# Altium project Phaser45.PrjPcb
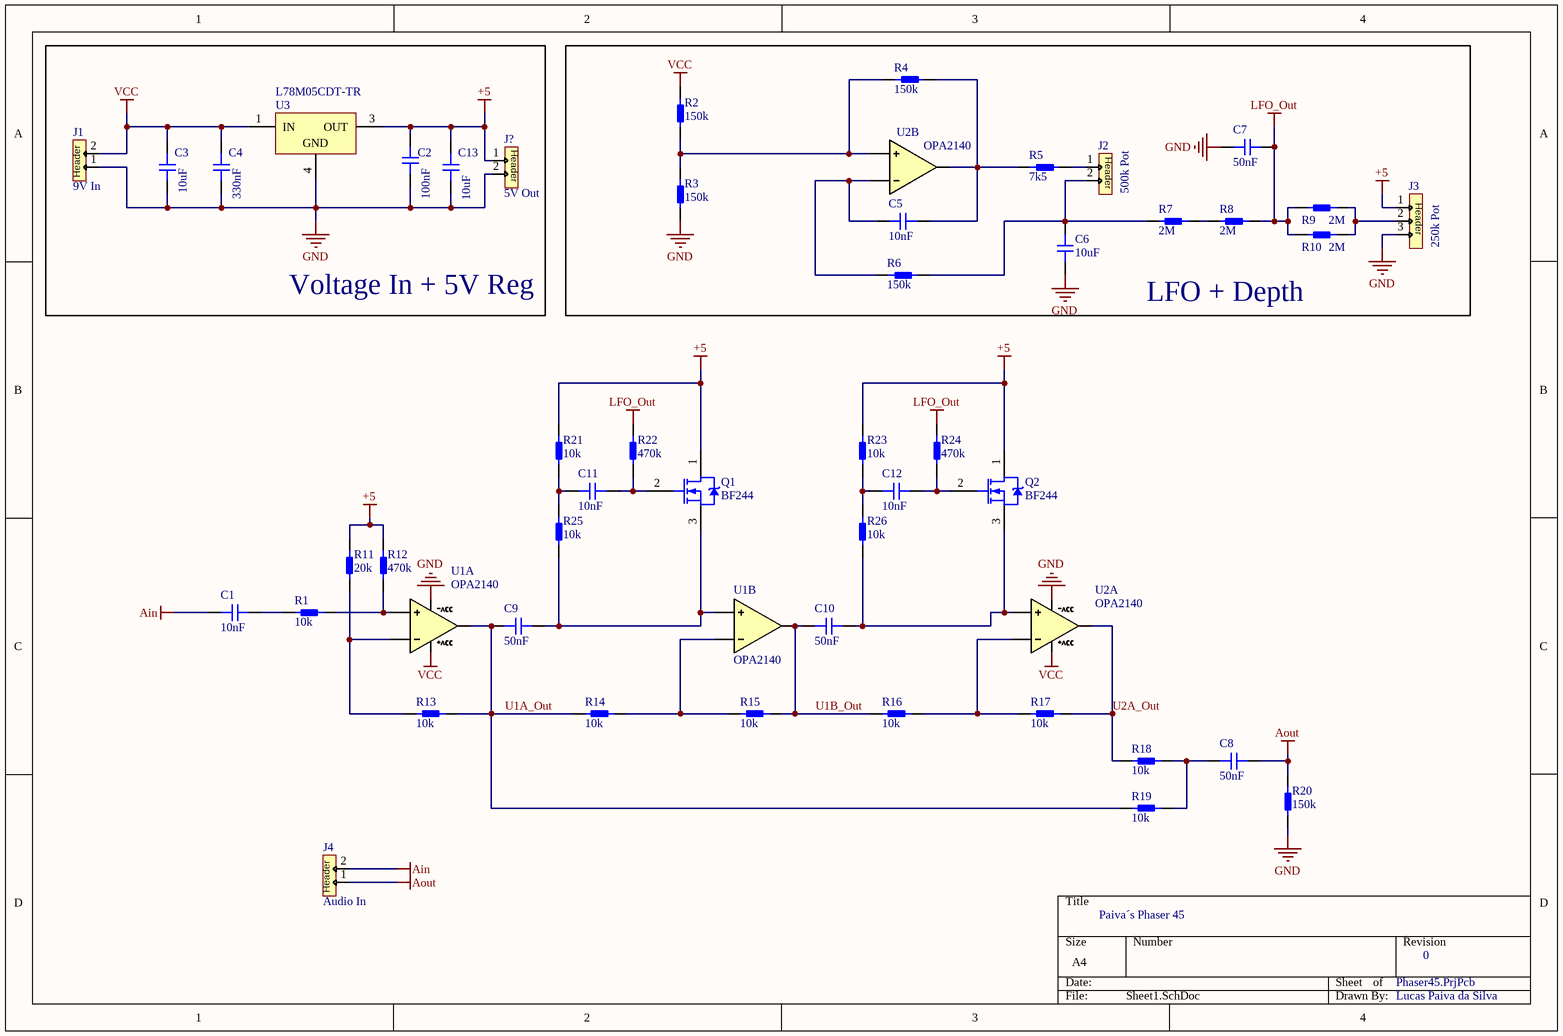
[diagram p0: Sheet1.SchDoc]
1 sheet, 49 parts. Net scope: global (net labels, ports and power ports of the same name join across sheets).
Board file: PCB1.PcbDoc

## Sheet Sheet1.SchDoc
size A4; Author: Lucas Paiva da Silva; Revision: 0; SheetNumber: 1; SheetTotal: 1

### Parts
C1  10nF  [SMD0805C]
C2  100nF  [SMD0805C]
C3  10uF  [SMD0805C]
C4  330nF  [SMD0805C]
C5  10nF  [SMD0805C]
C6  10uF  [SMD0805C]
C7  50nF  [SMD0805C]
C8  50nF  [SMD0805C]
C9  50nF  [SMD0805C]
C10  50nF  [SMD0805C]
C11  10nF  [SMD0805C]
C12  10nF  [SMD0805C]
C13  10uF  [SMD0805C]
J1  9V In  [PIN_HEAD_S_2_2.54]
J2  500k Pot  [PIN_HEAD_S_2_2.54]
J3  250k Pot  [PIN_HEAD_S_3_2.54]
J4  Audio In  [PIN_HEAD_S_2_2.54]
J?  5V Out  [PIN_HEAD_S_2_2.54]
Q1  BF244  [ONSC-TO-92-3-29-11]
Q2  BF244  [ONSC-TO-92-3-29-11]
R1  10k  [SMD1206R]
R2  150k  [SMD1206R]
R3  150k  [SMD1206R]
R4  150k  [SMD1206R]
R5  7k5  [SMD1206R]
R6  150k  [SMD1206R]
R7  2M  [SMD1206R]
R8  2M  [SMD1206R]
R9  2M  [SMD1206R]
R10  2M  [SMD1206R]
R11  20k  [SMD1206R]
R12  470k  [SMD1206R]
R13  10k  [SMD1206R]
R14  10k  [SMD1206R]
R15  10k  [SMD1206R]
R16  10k  [SMD1206R]
R17  10k  [SMD1206R]
R18  10k  [SMD1206R]
R19  10k  [SMD1206R]
R20  150k  [SMD1206R]
R21  10k  [SMD1206R]
R22  470k  [SMD1206R]
R23  10k  [SMD1206R]
R24  470k  [SMD1206R]
R25  10k  [SMD1206R]
R26  10k  [SMD1206R]
U1  OPA2140  [SOIC8]  (parts A,B of 2)
U2  OPA2140  [SOIC8]  (parts A,B of 2)
U3  L78M05CDT-TR  [TO-252_L]

### Blocks framed on the sheet
Voltage In + 5V Reg: C2-C4 C13 J1 J? U3
LFO + Depth: C5-C7 J2 J3 R2-R10 U2

### Nets
+5: C2.2 C13.2 J3.1 J?.1 Q1.1(D) Q2.1(D) R11.2 R12.2 R21.2 R23.2 U3.3(OUT)
Ain: C1.1 J4.2
Aout: C8.2 J4.1 R20.2
GND: C2.1 C3.1 C4.1 C6.2 C7.1 C13.1 J1.1 J3.3 J?.2 R3.1 R20.1 U1.4(-VCC) U2.4(-VCC) U3.4(GND)
LFO_Out: C7.2 R8.2 R9.1 R10.1 R22.2 R24.2
VCC: C3.2 C4.2 J1.2 R2.2 U1.8(+VCC) U2.8(+VCC) U3.1(IN)
U1A_Out: C9.1 R13.2 R14.1 R19.1 U1.1(OUT1)
U1B_Out: C10.1 R15.2 R16.1 U1.7(OUT2)
U2A_Out: R17.2 R18.1 U2.1(OUT1)
NetC1_2: C1.2 R1.1
NetC5_1: C5.1 R6.2 U2.6(IN2(-))
NetC5_2: C5.2 R4.1 R5.2 U2.7(OUT2)
NetC6_1: C6.1 J2.2 R6.1 R7.1
NetC8_1: C8.1 R18.2 R19.2
NetC9_2: C9.2 Q1.3(S) R25.1 U1.5(IN2(+))
NetC10_2: C10.2 Q2.3(S) R26.1 U2.3(IN1(+))
NetC11_1: C11.1 R21.1 R25.2
NetC11_2: C11.2 Q1.2(G) R22.1
NetC12_1: C12.1 R23.1 R26.2
NetC12_2: C12.2 Q2.2(G) R24.1
NetJ2_1: J2.1 R5.1
NetJ3_2: J3.2 R9.2 R10.2
NetR1_2: R1.2 R12.1 U1.3(IN1(+))
NetR2_1: R2.1 R3.2 R4.2 U2.5(IN2(+))
NetR7_2: R7.2 R8.1
NetR11_1: R11.1 R13.1 U1.2(IN1(-))
NetR14_2: R14.2 R15.1 U1.6(IN2(-))
NetR16_2: R16.2 R17.1 U2.2(IN1(-))

### Notes on the sheet
- Paiva´s Phaser 45
- (in symbol Header S 2 2.54mm) Header
- (in symbol Header S 3 2.54mm) Header

### Library data of the parts
C1-C13 = Capacitor
J1 J2 J4 J? = Header S 2 2.54mm: PinHead
J3 = Header S 3 2.54mm: PinHead
Q1 Q2 = CMP-1058-00929-1: Small Signal MOSFET, 500 mA, 60 V, N-Channel, 3-Pin TO-92, Bulk Box; Manufacturer: On Semiconductor; PartNumber: BS170; VGS Max (V): 20; Configuration: Single; PD Max (W): 0.35; VGS(th) Max (V): 3; ID Max (A): 0.5; V(BR)DSS Min (V): 60; Channel Polarity: N Channel; PackageDescription: 3-Pin Transistor Outline, Body 4.825 x 3.685 mm, Pitch 1.27 mm; Package Type: TO-92; ComponentLink1Description: Manufacturer URL; ComponentLink1URL: http://www.onsemi.com/; DatasheetVersion: Rev. 6; ComponentLink3Description: Package Specification; ComponentLink2URL: http://www.onsemi.com/pub_link/Collateral/BS170-D.PDF; PackageVersion: Rev. AM; Mounting Technology: Through Hole; PackageReference: TO-92-3-29-11_AM_SL; ComponentLink2Description: Datasheet; ComponentLink3URL: http://www.onsemi.cn/pub_link/Collateral/2N6426-D.PDF; Packing: Bulk Box
R1-R26 = Resistor: Resistor 1206 - SMD 0,25W; Parameter 1: *
U1 U2 = OPA2140: Dual High-precision OPAMP
U3 = CMP-0244-00178-1: Positive Voltage Regulator, 5V, 3-Pin DPAK, Tape and Reel; PackageReference: TO-252; ComponentLink1URL: http://www.st.com; ComponentLink2Description: Datasheet; PackageDescription: 3-Pin Transistor Outline Package 2.28 mm Pitch, 9.7 mm Lead Span (DPAK); ComponentLink1Description: Manufacturer URL; DatasheetVersion: 1/11/2010; ComponentLink2URL: http://www.st.com/internet/com/TECHNICAL_RESOURCES/TECHNICAL_LITERATURE/DATASHEET/CD00000447.pdf; PackageVersion: 2011